# EAGLE design Z80_Main (EAGLE 5.11)
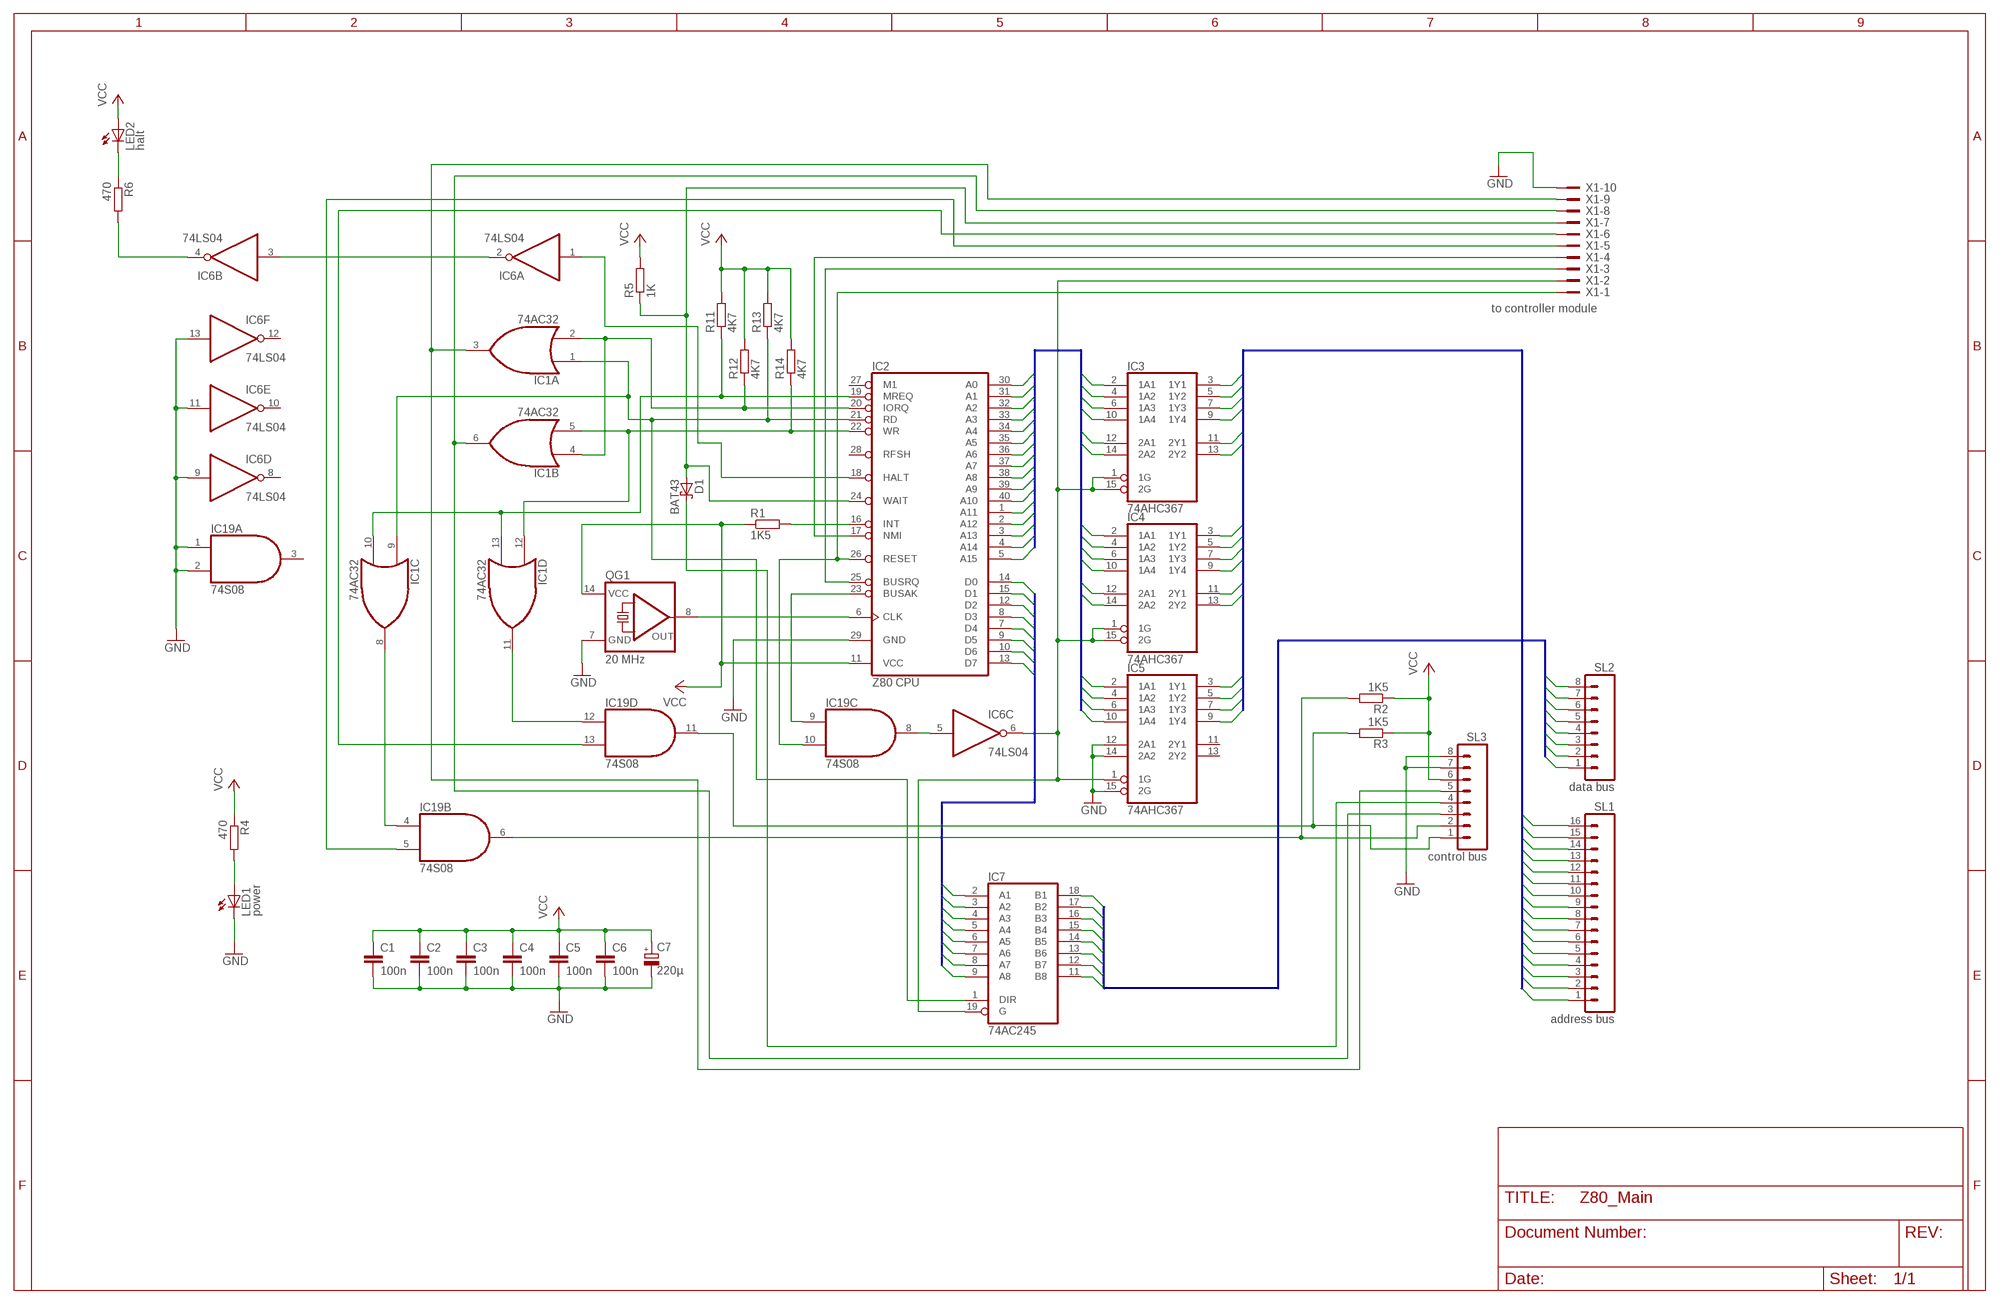
[diagram p0: schematic, sheet 1]

## Parts
C1  100n  C-EU050-025X075  [C050-025X075]
C2  100n  C-EU050-025X075  [C050-025X075]
C3  100n  C-EU050-025X075  [C050-025X075]
C4  100n  C-EU050-025X075  [C050-025X075]
C5  100n  C-EU050-025X075  [C050-025X075]
C6  100n  C-EU050-025X075  [C050-025X075]
C7  220µ  CPOL-EUE3.5-8  [E3,5-8]
D1  BAT43  BAT42  [DO35-10]
IC1  74AC32  74LS32N  [DIL14]
IC2  Z80 CPU  Z80CPU  [DIL40]
IC3  74AHC367  74367N  [DIL16]
IC4  74AHC367  74367N  [DIL16]
IC5  74AHC367  74367N  [DIL16]
IC6  74LS04  7404N  [DIL14]
IC7  74AC245  74LS245N  [DIL20]
IC19  74S08  74LS08N  [DIL14]
LED1  power  LED5MM  [LED5MM]
LED2  halt  LED5MM  [LED5MM]
QG1  20 MHz  QG5860  [DIL14S]
R1  1K5  R-EU_0207/7  [0207/7]
R2  1K5  R-EU_0207/10  [0207/10]
R3  1K5  R-EU_0207/10  [0207/10]
R4  470  R-EU_0207/10  [0207/10]
R5  1K  R-EU_0207/10  [0207/10]
R6  470  R-EU_0207/10  [0207/10]
R11  4K7  R-EU_0207/10  [0207/10]
R12  4K7  R-EU_0207/10  [0207/10]
R13  4K7  R-EU_0207/10  [0207/10]
R14  4K7  R-EU_0207/10  [0207/10]
SL1  address bus  M16  [16P]
SL2  data bus  M08  [08P]
SL3  control bus  M08  [08P]
X1  to controller module  2510-  [PAK100/2500-10]

## Nets
/BUSAK: IC2.23(BUSAK) IC19.9(C:I0)
/BUSRQ: IC2.25(BUSRQ) X1.3
/HALT: IC2.18(HALT) IC6.1(A:I)
/INT: IC2.17(NMI) X1.4
/IORD: IC1.3(A:O) SL3.5 X1.9
/IORQ: IC1.2(A:I1) IC1.4(B:I0) IC2.20(IORQ) R12.1
/IOWR: IC1.6(B:O) SL3.3 X1.8
/MEMRD: IC19.6(B:O) R2.2 SL3.2
/MEMRD_CPU: IC1.8(C:O) IC19.4(B:I0)
/MEMRD_PIC: IC19.5(B:I1) X1.5
/MEMWR: IC19.11(D:O) R3.2 SL3.1
/MEMWR_CPU: IC1.11(D:O) IC19.12(D:I0)
/MEMWR_PIC: IC19.13(D:I1) X1.6
/MREQ: IC1.10(C:I1) IC1.13(D:I1) IC2.19(MREQ) R11.1
/RD: IC1.1(A:I0) IC1.9(C:I0) IC2.21(RD) IC7.1(DIR) R13.1
/RESET: IC2.26(RESET) IC19.10(C:I1) X1.1
/WAIT: D1.A IC2.24(WAIT) R5.1 X1.7
/WAIT0: D1.C SL3.4
/WR: IC1.5(B:I1) IC1.12(D:I0) IC2.22(WR) R14.1
A0: IC2.30(A0) IC3.2(1A1)
A1: IC2.31(A1) IC3.4(1A2)
A2: IC2.32(A2) IC3.6(1A3)
A3: IC2.33(A3) IC3.10(1A4)
A4: IC2.34(A4) IC3.12(2A1)
A5: IC2.35(A5) IC3.14(2A2)
A6: IC2.36(A6) IC4.2(1A1)
A7: IC2.37(A7) IC4.4(1A2)
A8: IC2.38(A8) IC4.6(1A3)
A9: IC2.39(A9) IC4.10(1A4)
A10: IC2.40(A10) IC4.12(2A1)
A11: IC2.1(A11) IC4.14(2A2)
A12: IC2.2(A12) IC5.2(1A1)
A13: IC2.3(A13) IC5.4(1A2)
A14: IC2.4(A14) IC5.6(1A3)
A15: IC2.5(A15) IC5.10(1A4)
AB0: IC3.3(1Y1) SL1.1
AB1: IC3.5(1Y2) SL1.2
AB2: IC3.7(1Y3) SL1.3
AB3: IC3.9(1Y4) SL1.4
AB4: IC3.11(2Y1) SL1.5
AB5: IC3.13(2Y2) SL1.6
AB6: IC4.3(1Y1) SL1.7
AB7: IC4.5(1Y2) SL1.8
AB8: IC4.7(1Y3) SL1.9
AB9: IC4.9(1Y4) SL1.10
AB10: IC4.11(2Y1) SL1.11
AB11: IC4.13(2Y2) SL1.12
AB12: IC5.3(1Y1) SL1.13
AB13: IC5.5(1Y2) SL1.14
AB14: IC5.7(1Y3) SL1.15
AB15: IC5.9(1Y4) SL1.16
BUSAK_RESET: IC3.1(1G) IC3.15(2G) IC4.1(1G) IC4.15(2G) IC5.1(1G) IC6.6(C:O) IC7.19(G) X1.2
CLK: IC2.6(CLK) QG1.8(OUT)
D0: IC2.14(D0) IC7.2(A1)
D1: IC2.15(D1) IC7.3(A2)
D2: IC2.12(D2) IC7.4(A3)
D3: IC2.8(D3) IC7.5(A4)
D4: IC2.7(D4) IC7.6(A5)
D5: IC2.9(D5) IC7.7(A6)
D6: IC2.10(D6) IC7.8(A7)
D7: IC2.13(D7) IC7.9(A8)
DB0: IC7.18(B1) SL2.1
DB1: IC7.17(B2) SL2.2
DB2: IC7.16(B3) SL2.3
DB3: IC7.15(B4) SL2.4
DB4: IC7.14(B5) SL2.5
DB5: IC7.13(B6) SL2.6
DB6: IC7.12(B7) SL2.7
DB7: IC7.11(B8) SL2.8
GND: C1.2 C2.2 C3.2 C4.2 C5.2 C6.2 C7.- IC2.29(GND) IC5.12(2A1) IC5.14(2A2) IC5.15(2G) IC6.9(D:I) IC6.11(E:I) IC6.13(F:I) IC19.1(A:I0) IC19.2(A:I1) LED1.K(C) QG1.7(GND) SL3.7 SL3.8 X1.10
N$1: IC2.16(INT) R1.2
N$2: LED1.A R4.2
N$3: IC6.5(C:I) IC19.8(C:O)
N$4: IC6.2(A:O) IC6.3(B:I)
N$5: IC6.4(B:O) R6.2
N$6: LED2.K(C) R6.1
VCC: C1.1 C2.1 C3.1 C4.1 C5.1 C6.1 C7.+ IC2.11(VCC) LED2.A QG1.14(VCC) R1.1 R2.1 R3.1 R4.1 R5.2 R11.2 R12.2 R13.2 R14.2 SL3.6
Unconnected: IC2.27(M1) IC2.28(RFSH) IC5.11(2Y1) IC5.13(2Y2) IC6.8(D:O) IC6.10(E:O) IC6.12(F:O) IC19.3(A:O)

## Buses
A[0..15]
D[0..7]
AB[0..15]
DB[0..7]

## Power pins joined to a net without a drawn wire
GND: IC1.7(P:GND) IC3.8(GND) IC4.8(GND) IC5.8(GND) IC6.7(P:GND) IC7.10(GND) IC19.7(P:GND)
VCC: IC1.14(P:VCC) IC3.16(VCC) IC4.16(VCC) IC5.16(VCC) IC6.14(P:VCC) IC7.20(VCC) IC19.14(P:VCC)

## Library data of the parts
C1-C6 = rcl:C-EU: CAPACITOR, European symbol
C7 = rcl:CPOL-EU: POLARIZED CAPACITOR, European symbol
D1 = diode:BAT42: DIODE barrier diode
IC1 = 74xx-us:74*32: Quad 2-input OR gate
IC2 = zilog:Z80CPU: Z80 FAMILY DEVICE
IC3-IC5 = 74xx-eu:74*367: Hex BUS DRIVER, 3-state
IC6 = 74xx-eu:74*04: Hex INVERTER
IC7 = 74xx-us:74*245: Octal BUS TRANSCEIVER, 3-state
IC19 = 74xx-us:74*08: Quad 2-input AND gate
LED1 LED2 = led:LED: LED OSRAM: - CHIPLED LG R971, LG N971, LY N971, LG Q971, LY Q971, LO R971, LY R971 LH N974, LH R974 LS Q976, LO Q976, LY Q976 LO Q996 - Hyper CHIPLED LW Q18S LB Q993, LB Q99A, LB R99A - SideLED LS A670, LO A670, LY A670, LG A670, LP A670 LB A673, LV A673, LT A673, LW A673 LH A674 LY A675 LS A676, LA A676, LO A676, LY A676, LW A676 LS A679, LY A679, LG A679 - Hyper Micro SIDELED® LS Y876, LA Y876, LO Y876, LY Y876 LT Y87S - SmartLED LW L88C, LW L88S LB L89C, LB L89S, LG L890 LS L89K, LO L89K, LY L89K LS L896, LA L896, LO L896, LY L896 - TOPLED LS T670, LO T670, LY T670, LG T670, LP T670 LSG T670, LSP T670, LSY T670, LOP T670, LYG T670 LG T671, LOG T671, LSG T671 LB T673, LV T673, LT T673, LW T673 LH T674 LS T676, LA T676, LO T676, LY T676, LB T676, LH T676, LSB T676, LW T676 LB T67C, LV T67C, LT T67C, LS T67K, LO T67K, LY T67K, LW E67C LS E67B, LA E67B, LO E67B, LY E67B, LB E67C, LV E67C, LT E67C LW T67C LS T679, LY T679, LG T679 LS T770, LO T770, LY T770, LG T770, LP T770 LB T773, LV T773, LT T773, LW T773 LH T774 LS E675, LA E675, LY E675, LS T675 LS T776, LA T776, LO T776, LY T776, LB T776 LHGB T686 LT T68C, LB T68C - Hyper Mini TOPLED® LB M676 - Mini TOPLED Santana® LG M470 LS M47K, LO M47K, LY M47K Source: http://www.osram.convergy.de LUXEON: - LUMILED® LXK2-PW12-R00, LXK2-PW12-S00, LXK2-PW14-U00, LXK2-PW14-V00 LXK2-PM12-R00, LXK2-PM12-S00, LXK2-PM14-U00 LXK2-PE12-Q00, LXK2-PE12-R00, LXK2-PE12-S00, LXK2-PE14-T00, LXK2-PE14-U00 LXK2-PB12-K00, LXK2-PB12-L00, LXK2-PB12-M00, LXK2-PB14-N00, LXK2-PB14-P00, LXK2-PB14-Q00 LXK2-PR12-L00, LXK2-PR12-M00, LXK2-PR14-Q00, LXK2-PR14-R00 LXK2-PD12-Q00, LXK2-PD12-R00, LXK2-PD12-S00 LXK2-PH12-R00, LXK2-PH12-S00 LXK2-PL12-P00, LXK2-PL12-Q00, LXK2-PL12-R00 Source: www.luxeon.com KINGBRIGHT: KA-3528ASYC Source: www.kingbright.com
QG1 = crystal:QG5860: CRYSTAL RESONATOR
R1 = resistor:R-EU_: RESISTOR, European symbol
R2-R6 R11-R14 = rcl:R-EU_: RESISTOR, European symbol
SL1 = con-amp-quick:M16: AMP QUICK CONNECTOR
SL2 SL3 = con-amp-quick:M08: AMP QUICK CONNECTOR
X1 = con-3m:2510-: 3M (TM) Pak 100 4-Wall Header Source: 3M

## Board
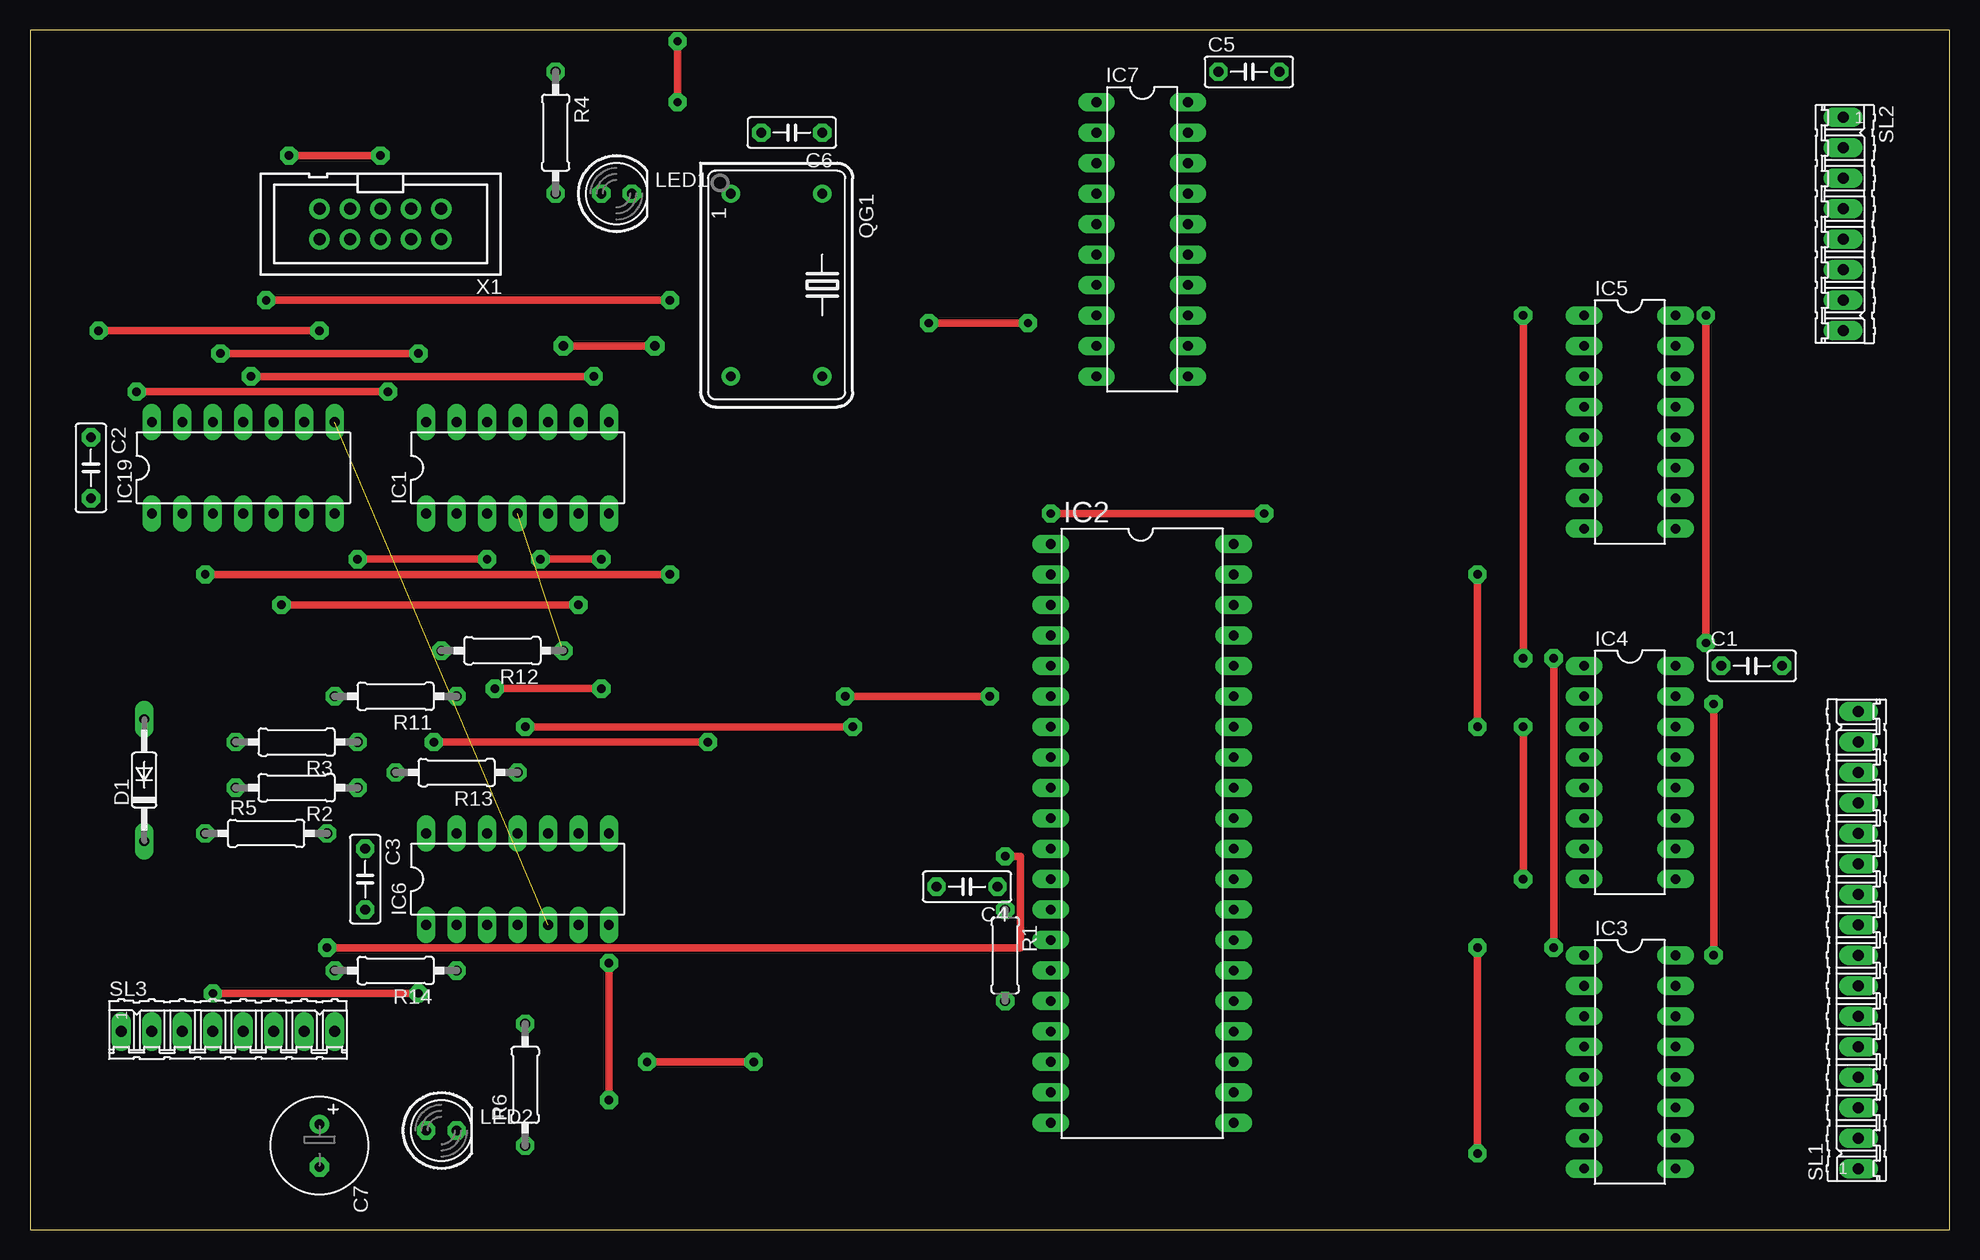
[diagram p1: board, top side]
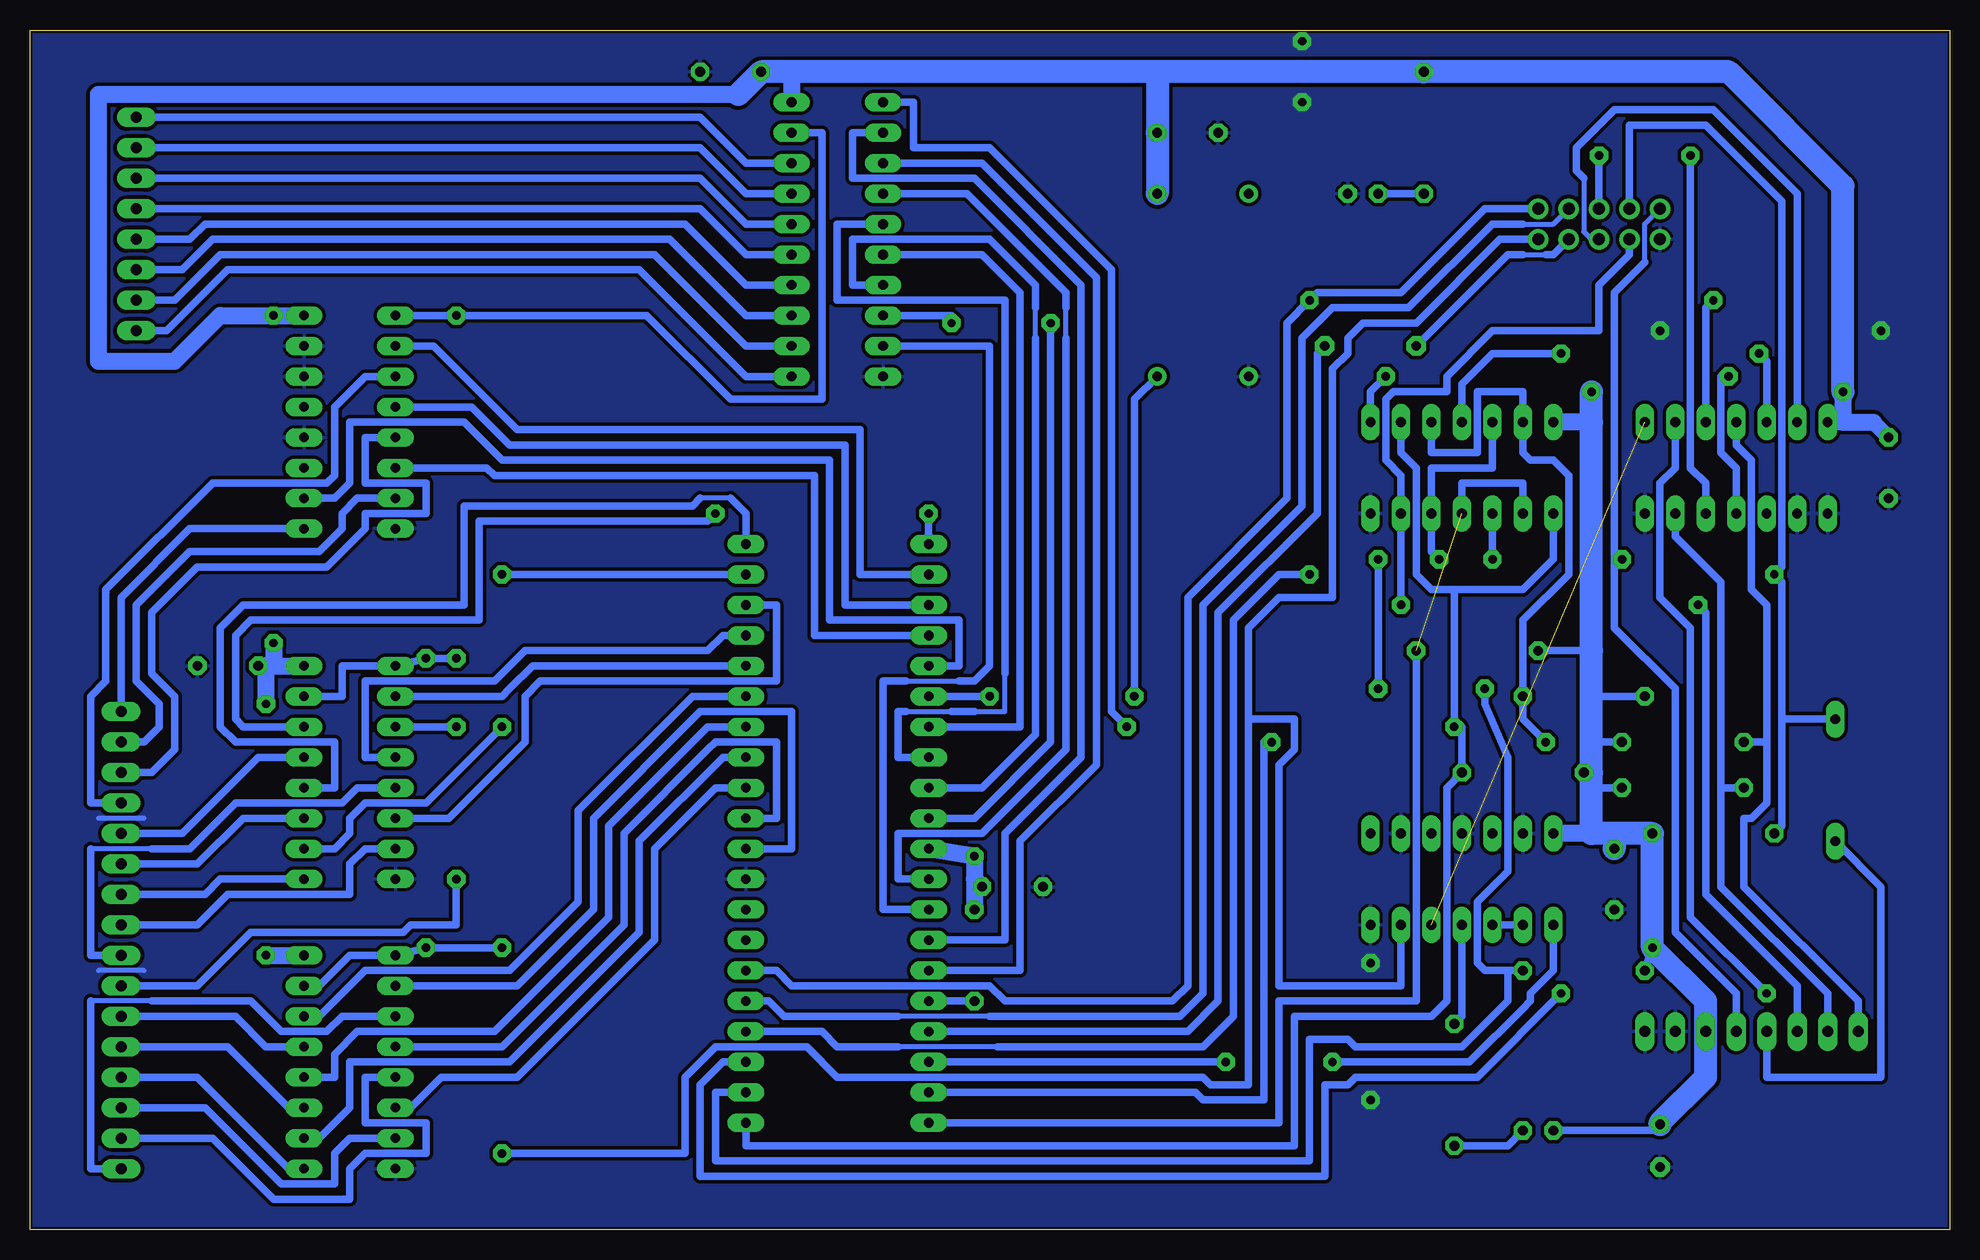
[diagram p2: board, bottom side, seen from below]

Size 160 x 100 mm. Coordinates in mm from the lower left corner, seen from the top.
Outline: 0,0 160,0 160,100 0,100 0,0
Copper layers (1*16): Top 0.035mm / dielectric 1.5mm / Bottom 0.035mm
Design rules "default *": minimum track width 16mil, minimum drill 24mil, track to track 12mil, track to pad 12mil, pad to pad 8mil, via to via 8mil, smd to smd 8mil, copper to edge 8mil, drill to drill 8mil, minimum pad ring 14mil, minimum via ring 16mil, stop-mask expansion 4mil, vias tented up to drill 0mil, thermal gap 10mil

### Footprints (pad centres in the part's own frame; a part is rotated, then mirrored left to right if it is on the bottom)
C050-025X075 = drill 0.813 octagon: 1 -2.54,0; 2 2.54,0
E3,5-8 = drill 0.813 pad 1.6 round: + -1.778,0 | drill 0.813 pad 1.6 octagon: - 1.778,0
DO35-10 = drill 0.813 long: A 5.08,0; C -5.08,0
DIL14 = drill 0.813 long: 1 -7.62,-3.81; 2 -5.08,-3.81; 3 -2.54,-3.81; 4 0,-3.81; 5 2.54,-3.81; 6 5.08,-3.81; 7 7.62,-3.81; 8 7.62,3.81; 9 5.08,3.81; 10 2.54,3.81; 11 0,3.81; 12 -2.54,3.81; 13 -5.08,3.81; 14 -7.62,3.81
DIL40 = drill 0.813 long: 1 -24.13,-7.62; 2 -21.59,-7.62; 3 -19.05,-7.62; 4 -16.51,-7.62; 5 -13.97,-7.62; 6 -11.43,-7.62; 7 -8.89,-7.62; 8 -6.35,-7.62; 9 -3.81,-7.62; 10 -1.27,-7.62; 11 1.27,-7.62; 12 3.81,-7.62; 13 6.35,-7.62; 14 8.89,-7.62; 15 11.43,-7.62; 16 13.97,-7.62; 17 16.51,-7.62; 18 19.05,-7.62; 19 21.59,-7.62; 20 24.13,-7.62; 21 24.13,7.62; 22 21.59,7.62; 23 19.05,7.62; 24 16.51,7.62; 25 13.97,7.62; 26 11.43,7.62; 27 8.89,7.62; 28 6.35,7.62; 29 3.81,7.62; 30 1.27,7.62; 31 -1.27,7.62; 32 -3.81,7.62; 33 -6.35,7.62; 34 -8.89,7.62; 35 -11.43,7.62; 36 -13.97,7.62; 37 -16.51,7.62; 38 -19.05,7.62; 39 -21.59,7.62; 40 -24.13,7.62
DIL16 = drill 0.813 long: 1 -8.89,-3.81; 2 -6.35,-3.81; 3 -3.81,-3.81; 4 -1.27,-3.81; 5 1.27,-3.81; 6 3.81,-3.81; 7 6.35,-3.81; 8 8.89,-3.81; 9 8.89,3.81; 10 6.35,3.81; 11 3.81,3.81; 12 1.27,3.81; 13 -1.27,3.81; 14 -3.81,3.81; 15 -6.35,3.81; 16 -8.89,3.81
DIL20 = drill 0.813 long: 1 -11.43,-3.81; 2 -8.89,-3.81; 3 -6.35,-3.81; 4 -3.81,-3.81; 5 -1.27,-3.81; 6 1.27,-3.81; 7 3.81,-3.81; 8 6.35,-3.81; 9 8.89,-3.81; 10 11.43,-3.81; 11 11.43,3.81; 12 8.89,3.81; 13 6.35,3.81; 14 3.81,3.81; 15 1.27,3.81; 16 -1.27,3.81; 17 -3.81,3.81; 18 -6.35,3.81; 19 -8.89,3.81; 20 -11.43,3.81
LED5MM = drill 0.813 octagon: A -1.27,0; K 1.27,0
DIL14S = drill 0.813 round: 1 -7.62,-3.81; 7 7.62,-3.81; 8 7.62,3.81; 14 -7.62,3.81
0207/7 = drill 0.813 octagon: 1 -3.81,0; 2 3.81,0
0207/10 = drill 0.813 octagon: 1 -5.08,0; 2 5.08,0
16P = drill 0.914 long: 1 -19.05,0; 2 -16.51,0; 3 -13.97,0; 4 -11.43,0; 5 -8.89,0; 6 -6.35,0; 7 -3.81,0; 8 -1.27,0; 9 1.27,0; 10 3.81,0; 11 6.35,0; 12 8.89,0; 13 11.43,0; 14 13.97,0; 15 16.51,0; 16 19.05,0
08P = drill 0.914 long: 1 -8.89,0; 2 -6.35,0; 3 -3.81,0; 4 -1.27,0; 5 1.27,0; 6 3.81,0; 7 6.35,0; 8 8.89,0
PAK100/2500-10 = drill 1 pad 1.422 round: 1 -5.08,-1.27; 2 -5.08,1.27; 3 -2.54,-1.27; 4 -2.54,1.27; 5 0,-1.27; 6 0,1.27; 7 2.54,-1.27; 8 2.54,1.27; 9 5.08,-1.27; 10 5.08,1.27

### Placement (x,y rotation side)
C1  143.51,46.99 0 top
C2  5.08,63.5 270 top
C3  27.94,29.21 270 top
C4  78.11,28.57 180 top
C5  101.6,96.52 0 top
C6  63.5,91.44 180 top
C7  24.13,6.99 270 top
D1  9.53,37.47 90 top
IC1  40.64,63.5 0 top
IC2  92.71,33.02 270 top
IC3  133.35,13.97 270 top
IC4  133.35,38.1 270 top
IC5  133.35,67.31 270 top
IC6  40.64,29.21 0 top
IC7  92.71,82.55 270 top
IC19  17.78,63.5 0 top
LED1  48.9,86.36 0 top
LED2  34.29,8.26 0 top
QG1  62.23,78.74 270 top
R1  81.28,22.86 270 top
R2  22.23,36.83 180 top
R3  22.23,40.64 180 top
R4  43.81,91.44 270 top
R5  19.68,33.02 0 top
R6  41.27,12.06 90 top
R11  30.48,44.45 180 top
R12  39.37,48.26 180 top
R13  35.56,38.1 180 top
R14  30.48,21.59 180 top
SL1  152.4,24.13 90 top
SL2  151.13,83.82 270 top
SL3  16.51,16.51 0 top
X1  29.21,83.82 180 top

### Tracks (layer width: path | path; a pad name or v marks a point on that pad's centre or on a via)
/BUSAK  (via drill 0.7)
  Top 0.61: v15.24,19.68 v32.38,19.68
  Bottom 0.61: IC2.23 102.23,13.97 104.14,12.06 104.14,4.45 52.07,4.45 52.07,12.06 50.16,12.06 49.53,12.7 39.37,12.7 v32.38,19.68 | IC19.9 22.86,63.5 24.13,62.23 24.13,52.7 21.59,50.16 21.59,26.04 v15.24,19.68
/BUSRQ
  Bottom 0.406: 35.56,83.82 33.02,83.82 X1.3 | 80.01,17.78 87.63,17.78
  Bottom 0.61: IC2.25 98.42,19.05 97.16,17.78 87.63,17.78 | 35.56,83.82 38.1,83.82 45.09,76.83 51.44,76.83 53.98,74.3 53.98,60.33 62.23,52.07 62.23,19.68 64.14,17.78 80.01,17.78
/HALT  (via drill 0.7)
  Top 0.61: v51.44,13.97 v60.33,13.97
  Bottom 0.61: IC6.1 33.02,21.59 34.92,19.68 34.92,19.05 35.56,18.41 40.01,13.97 v51.44,13.97 | v60.33,13.97 IC2.18
/INT  (via drill 0.8)
  Top 0.61: v52.07,73.66 v44.45,73.66
  Bottom 0.406: 35.56,81.28 33.66,81.28
  Bottom 0.61: IC2.17 63.5,16.51 60.96,19.05 60.96,51.44 52.7,59.69 52.7,73.03 v52.07,73.66 | X1.4 33.02,81.28 33.66,81.28 | 35.56,81.28 36.83,81.28 v44.45,73.66
/IORD  (via drill 0.7)
  Top 0.61: v27.3,55.88 v38.1,55.88
  Bottom 0.406: 25.4,80.64 25.4,83.82 X1.9
  Bottom 0.61: 27.94,55.88 27.94,78.11 25.4,80.64 | 27.94,55.88 27.94,50.16 22.86,45.09 22.86,24.77 17.78,19.68 SL3.5 | 27.94,55.88 v27.3,55.88 | v38.1,55.88 IC1.3
/IORQ  (1 unrouted)
  Bottom 0.61: IC2.20 55.88,8.89 55.88,19.05 44.45,19.05 R12.1 | IC1.2 35.56,62.23 40.64,62.23 IC1.4
/IOWR  (via drill 0.7)
  Top 0.61: v20.95,52.07 v45.72,52.07
  Bottom 0.61: X1.8 26.67,81.28 29.21,78.74 29.21,74.93 38.1,74.93 41.91,71.12 41.91,69.85 46.35,69.85 46.99,69.22 46.99,64.14 45.72,62.87 IC1.6 v45.72,52.07 | SL3.3 12.7,20.32 20.32,27.94 20.32,51.44 v20.95,52.07
/MEMRD
  Bottom 0.61: IC19.6 22.86,57.78 19.05,53.98 19.05,36.83 | 19.05,36.83 19.05,28.57 10.16,19.68 SL3.2 | 19.05,36.83 R2.2
/MEMRD_CPU  (via drill 0.7)
  Top 0.61: v18.41,71.12 v46.99,71.12
  Bottom 0.61: IC19.4 17.78,63.5 19.05,64.77 19.05,71.12 v18.41,71.12 | v46.99,71.12 48.26,69.85 IC1.8
/MEMRD_PIC  (via drill 0.7)
  Top 0.61: v21.59,89.53 v29.21,89.53
  Bottom 0.61: v21.59,89.53 21.59,76.83 21.59,63.5 20.32,62.23 IC19.5 | v29.21,89.53 X1.5
/MEMWR
  Bottom 0.61: IC19.11 17.78,65.41 16.51,64.14 16.51,53.34 15.24,52.07 15.24,40.64 | 15.24,40.64 15.24,35.56 16.51,34.29 17.14,34.29 17.14,28.57 7.62,19.05 SL3.1 | 15.24,40.64 R3.2
/MEMWR_CPU  (via drill 0.7)
  Top 0.61: v15.88,73.03 v32.38,73.03
  Bottom 0.61: IC19.12 15.24,72.39 v15.88,73.03 | v32.38,73.03 38.1,73.03 40.64,70.48 IC1.11
/MEMWR_PIC
  Bottom 0.406: 30.48,87.63 30.48,83.19 29.84,82.55 X1.6
  Bottom 0.61: IC19.13 12.7,86.36 19.68,93.34 27.94,93.34 31.11,90.17 31.11,88.27 30.48,87.63
/MREQ  (via drill 0.7)
  Top 0.61: v56.52,40.64 v33.66,40.64
  Bottom 0.61: IC2.19 80.01,11.43 62.87,11.43 62.23,10.79 57.15,10.79 57.15,40.64 v56.52,40.64 | v33.66,40.64 35.56,42.55 R11.1 35.56,50.8 31.75,54.61 31.75,62.87 33.02,64.14 34.92,64.14 35.56,64.77 IC1.13 35.56,69.85 39.37,69.85 39.37,64.77 43.18,64.77 IC1.10
/RD  (via drill 0.7)
  Top 0.61: v41.27,41.91 v68.58,41.91
  Bottom 0.61: IC7.1 86.36,93.98 86.36,90.17 80.01,90.17 69.85,80.01 69.85,43.18 v68.58,41.91 | IC2.21 100.33,6.99 54.61,6.99 54.61,17.78 43.18,17.78 41.91,19.05 41.91,20.32 41.91,36.83 R13.1 40.64,41.91 v41.27,41.91 41.27,53.34 | IC1.1 33.02,55.88 35.56,53.34 41.27,53.34 | 41.27,53.34 43.18,53.34 44.45,54.61 44.45,63.5 45.72,64.77 IC1.9
/RESET  (via drill 0.7)
  Top 0.61: v53.34,77.47 v19.68,77.47
  Bottom 0.61: IC2.26 97.79,21.59 96.52,20.32 80.01,20.32 78.74,19.05 64.77,19.05 63.5,20.32 63.5,52.7 55.24,60.96 55.24,75.56 v53.34,77.47 52.7,78.11 45.72,78.11 38.73,85.09 X1.1 | v19.68,77.47 20.32,76.83 IC19.10
/WAIT  (via drill 0.7)
  Top 0.61: v14.61,54.61 v53.34,54.61
  Bottom 0.406: 79.38,15.24 87.63,15.24
  Bottom 0.61: X1.7 26.67,92.08 20.32,92.08 13.97,85.72 13.97,55.24 v14.61,54.61 13.97,53.98 13.97,42.55 | v53.34,54.61 55.88,54.61 59.69,50.8 59.69,17.78 62.23,15.24 79.38,15.24 | IC2.24 93.98,16.51 92.71,15.24 87.63,15.24 | 13.97,42.55 D1.A | R5.1 13.97,33.66 13.97,42.55
/WAIT0
  Bottom 0.61: SL3.4 15.24,12.7 5.71,12.7 5.71,28.57 D1.C
/WR  (via drill 0.7)
  Top 0.61: v47.62,55.88 v42.55,55.88 | v38.73,45.09 v47.62,45.09
  Bottom 0.61: IC2.22 102.87,11.43 102.87,5.71 53.34,5.71 53.34,15.88 50.16,15.88 49.53,15.24 40.64,15.24 36.83,19.05 36.83,21.59 | 36.83,21.59 R14.1 | v38.73,45.09 38.73,43.81 36.83,39.37 36.83,29.84 39.37,27.3 39.37,22.23 38.73,21.59 36.83,21.59 | IC1.12 38.1,63.5 43.18,63.5 IC1.5 43.18,56.52 v42.55,55.88 | v47.62,45.09 v47.62,55.88
A0
  Bottom 0.61: IC3.2 119.38,20.32 113.03,26.67 113.03,34.29 104.78,42.55 104.14,43.18 96.52,43.18 96.52,31.75 IC2.30
A1
  Bottom 0.61: IC3.4 120.65,15.24 110.49,25.4 110.49,33.02 103.5,40.01 102.87,40.64 97.79,40.64 97.79,34.29 IC2.31
A2
  Bottom 0.61: IC3.6 128.27,10.16 125.73,12.7 119.38,12.7 107.95,24.13 107.95,31.75 102.87,36.83 IC2.32
A3
  Bottom 0.61: IC3.10 135.89,7.62 133.35,10.16 133.35,13.97 120.02,13.97 109.22,24.77 109.22,32.38 102.23,39.37 IC2.33
A4
  Bottom 0.61: IC2.34 103.5,41.91 111.76,33.66 111.76,26.04 121.28,16.51 132.72,16.51 134.62,14.61 134.62,12.7 IC3.12
A5
  Bottom 0.61: IC3.14 135.89,17.78 132.08,21.59 120.02,21.59 114.3,27.3 114.3,34.92 104.78,44.45 IC2.35
A6
  Bottom 0.61: IC2.36 118.11,46.99 120.02,45.09 120.65,44.45 IC4.2
A7
  Bottom 0.61: IC2.37 102.23,49.53 103.5,48.26 118.75,48.26 121.28,45.72 132.08,45.72 132.08,39.37 IC4.4
A8
  Bottom 0.61: IC4.6 125.09,34.29 118.75,40.64 118.75,44.45 117.47,45.72 97.79,45.72 97.79,52.07 IC2.38
A9  (via drill 0.7)
  Top 0.61: v120.65,54.61 v120.65,41.91
  Bottom 0.61: IC4.10 134.62,31.75 133.35,33.02 133.35,34.29 132.08,35.56 127,35.56 v120.65,41.91 | IC2.39 v120.65,54.61
A10
  Bottom 0.406: 101.6,60.96 104.14,60.96
  Bottom 0.61: IC4.12 134.62,36.83 134.62,40.64 142.88,40.64 144.15,41.91 144.15,50.16 142.24,52.07 123.83,52.07 123.83,60.33 104.78,60.33 104.14,60.96 | 101.6,60.96 100.33,59.69 IC2.40
A11  (via drill 0.7)
  Top 0.61: v85.09,59.69 v102.87,59.69
  Bottom 0.61: IC4.14 141.6,41.91 142.24,41.91 142.88,42.55 142.88,49.53 141.6,50.8 122.56,50.8 122.56,59.05 103.5,59.05 v102.87,59.69 | IC2.1 v85.09,59.69
A12
  Bottom 0.61: IC5.2 126.36,73.66 119.38,66.67 90.81,66.67 90.81,54.61 IC2.2
A13
  Bottom 0.61: IC2.3 92.08,52.07 92.08,65.41 120.02,65.41 123.19,68.58 IC5.4
A14
  Bottom 0.61: IC5.6 121.92,63.5 121.28,62.87 94.61,62.87 94.61,49.53 IC2.4
A15
  Bottom 0.61: IC5.10 134.62,60.96 133.35,62.23 133.35,67.31 123.83,67.31 120.65,64.14 93.34,64.14 93.34,50.8 82.55,50.8 82.55,46.99 IC2.5
AB0
  Bottom 0.406: 149.86,19.05 154.94,19.05
  Bottom 0.61: IC3.3 133.99,17.78 135.25,16.51 139.06,16.51 141.6,19.05 149.86,19.05 | 154.94,19.05 154.94,5.08 SL1.1
AB1
  Bottom 0.61: IC3.5 132.08,12.7 132.08,8.89 127,8.89 127,6.35 132.08,6.35 133.35,5.08 133.35,2.54 139.7,2.54 144.78,7.62 SL1.2
AB2
  Bottom 0.61: IC3.7 133.35,7.62 134.62,6.35 134.62,3.81 139.06,3.81 145.41,10.16 SL1.3
AB3
  Bottom 0.61: IC3.9 138.43,5.08 146.05,12.7 SL1.4
AB4
  Bottom 0.61: IC3.11 138.43,10.16 143.51,15.24 SL1.5
AB5
  Bottom 0.61: IC3.13 140.34,15.24 142.88,17.78 SL1.6
AB6  (via drill 0.7)
  Top 0.61: v124.46,29.21 v124.46,41.91
  Bottom 0.61: v124.46,29.21 124.46,25.4 128.27,25.4 128.91,24.77 141.6,24.77 146.05,20.32 SL1.7 | v124.46,41.91 IC4.3
AB7
  Bottom 0.406: 149.86,31.75 154.94,31.75
  Bottom 0.61: IC4.5 132.72,36.83 133.99,35.56 142.88,35.56 146.69,31.75 149.86,31.75 | 154.94,31.75 154.94,22.86 SL1.8
AB8
  Bottom 0.61: IC4.7 132.08,31.75 133.35,30.48 133.35,27.94 143.51,27.94 146.05,25.4 SL1.9
AB9
  Bottom 0.61: IC4.9 144.15,29.21 145.41,27.94 SL1.10
AB10
  Bottom 0.61: IC4.11 142.24,34.29 146.05,30.48 SL1.11
AB11
  Bottom 0.61: IC4.13 140.97,39.37 147.32,33.02 SL1.12
AB12
  Bottom 0.61: IC5.3 132.08,71.12 134.62,68.58 134.62,62.87 135.25,62.23 144.78,62.23 153.67,53.34 153.67,45.72 154.94,44.45 154.94,35.56 SL1.13
AB13
  Bottom 0.61: IC5.5 132.08,66.04 132.08,62.23 127,62.23 127,59.69 132.08,59.69 132.08,58.42 135.25,55.24 146.05,55.24 149.86,51.44 149.86,46.35 147.96,44.45 147.96,40.01 149.86,38.1 SL1.14
AB14
  Bottom 0.61: IC5.7 132.72,60.96 133.99,59.69 133.99,58.42 135.89,56.52 146.69,56.52 151.13,52.07 151.13,45.72 149.22,43.81 149.22,41.91 150.5,40.64 SL1.15
AB15
  Bottom 0.61: SL1.16 152.4,52.7 146.69,58.42 IC5.9
BUSAK_RESET  (via drill 0.7)
  Top 0.61: v127,23.5 v127,47.62 | v124.46,47.62 v124.46,76.2 | v120.65,6.35 v120.65,23.5
  Bottom 0.61: IC3.15 135.89,20.32 133.35,22.86 IC3.1 v127,23.5 v120.65,23.5 | IC4.15 133.99,44.45 133.99,46.99 IC4.1 v127,47.62 v124.46,47.62 | IC5.1 v124.46,76.2 108.58,76.2 101.6,69.22 93.98,69.22 93.98,91.44 IC7.19 | v120.65,6.35 105.41,6.35 105.41,12.7 102.87,15.24 95.25,15.24 92.71,12.7 62.23,12.7 61.59,12.06 58.42,12.06 58.42,42.55 | 58.42,42.55 58.42,50.16 55.88,52.7 51.44,52.7 51.44,71.75 50.16,73.03 50.16,74.3 48.9,75.56 44.45,75.56 37.47,82.55 X1.2 | IC6.6 45.72,20.32 55.88,20.32 55.88,38.73 54.61,40.01 54.61,42.55 58.42,42.55
CLK  (via drill 0.7)
  Top 0.61: v67.94,44.45 v80.01,44.45
  Bottom 0.61: v80.01,44.45 IC2.6 | v67.94,44.45 67.94,69.22 QG1.8
D0
  Bottom 0.61: IC2.14 78.74,24.13 78.74,33.02 72.39,39.37 72.39,78.74 81.28,87.63 91.44,87.63 91.44,91.44 IC7.2
D1
  Bottom 0.61: IC7.3 80.64,88.9 71.12,79.38 71.12,38.73 77.47,32.38 77.47,21.59 IC2.15
D2
  Bottom 0.406: 73.66,74.3 73.66,76.83
  Bottom 0.61: IC7.4 81.92,86.36 73.66,78.11 73.66,76.83 | IC2.12 87.63,29.21 87.63,33.02 80.64,33.02 73.66,40.01 73.66,74.3
D3
  Bottom 0.406: 87,43.18 83.19,43.18 | 81.28,43.18 78.74,43.18 78.74,46.35
  Bottom 0.61: IC2.8 87.63,39.37 87.63,43.18 87,43.18 | IC7.5 92.71,83.82 92.71,77.47 78.74,77.47 78.74,46.35 | 83.19,43.18 81.28,43.18
D4
  Bottom 0.61: IC2.7 77.47,41.91 77.47,78.11 80.64,81.28 IC7.6
D5
  Bottom 0.406: 76.2,74.3 76.2,76.83
  Bottom 0.61: IC7.7 91.44,78.74 91.44,82.55 80.01,82.55 76.2,78.74 76.2,76.83 | IC2.9 80.64,36.83 76.2,41.27 76.2,74.3
D6  (via drill 0.7)
  Top 0.61: v74.93,75.56 v83.19,75.56
  Bottom 0.61: IC2.10 81.28,34.29 74.93,40.64 v74.93,75.56 | v83.19,75.56 83.19,76.2 IC7.8
D7
  Bottom 0.406: 87,45.72 82.55,45.72
  Bottom 0.61: IC2.13 88.9,26.67 88.9,45.72 87.63,45.72 87,45.72 | IC7.9 80.01,73.66 80.01,46.99 81.28,45.72 82.55,45.72
DB0
  Bottom 0.61: IC7.18 100.33,88.9 104.14,92.71 SL2.1
DB1
  Bottom 0.61: IC7.17 100.33,86.36 104.14,90.17 SL2.2
DB2
  Bottom 0.61: IC7.16 100.33,83.82 104.14,87.63 SL2.3
DB3
  Bottom 0.61: IC7.15 100.33,81.28 104.14,85.09 SL2.4
DB4
  Bottom 0.61: IC7.14 100.33,78.74 105.41,83.82 144.78,83.82 145.41,83.82 146.69,82.55 SL2.5
DB5
  Bottom 0.61: IC7.13 100.33,76.2 106.68,82.55 144.78,82.55 147.32,80.01 SL2.6
DB6
  Bottom 0.61: IC7.12 100.33,73.66 107.95,81.28 144.15,81.28 147.96,77.47 SL2.7
DB7
  Bottom 0.61: IC7.11 100.33,71.12 109.22,80.01 143.51,80.01 148.59,74.93 SL2.8
GND  (via drill 0.7)
  Top 0.61: v48.26,10.79 v48.26,22.23 | v5.71,74.93 v24.13,74.93 | v53.98,93.98 v53.98,99.06
  Bottom 0.406: 150.5,21.59 154.31,21.59 | 150.5,34.29 154.31,34.29
  pour Bottom: 0,100.33 0,0 160.02,0 160.02,100.33
N$1
  Bottom 0.61: R1.2 IC2.16
N$2
  Bottom 0.61: R4.2 LED1.A
N$3  (1 unrouted)
N$4
  Bottom 0.61: IC6.2 IC6.3
N$5
  Bottom 0.61: R6.2 40.64,17.78 40.64,18.41 IC6.4
N$6
  Bottom 0.61: LED2.K 36.83,6.99 R6.1
VCC  (via drill 0.7)
  Top 0.61: v140.34,43.81 v140.34,22.86 | v29.84,69.85 v8.89,69.85 | v139.7,76.2 v139.7,48.9 | v24.77,23.5 82.55,23.5 82.55,31.11 v81.28,31.11
  Bottom 0.61: 29.84,44.45 R11.2 | 29.84,48.26 R12.2 | v24.77,23.5 R14.2 | 29.84,38.1 R13.2 | 29.84,40.64 R3.1 | 29.84,36.83 R2.1 | LED2.A 24.64,8.26 C7.+
  Bottom 1.27: 139.7,46.99 140.34,46.99 | 6.35,67.31 C2.1 | IC7.20 96.52,95.25
  Bottom 1.422: 29.84,33.02 IC6.14 | 29.84,67.31 IC1.14 | 81.28,29.21 R1.1 | 81.28,29.21 v81.28,31.11 IC2.11 | v140.34,22.86 IC3.16 | v140.34,43.81 140.34,46.99 C1.1 | 96.52,96.52 IC7.20 | v139.7,48.9 139.7,46.99 IC4.16 | IC5.16 v139.7,76.2 144.15,76.2 147.96,72.39 154.31,72.39 154.31,94.61 100.97,94.61 | 81.28,29.21 C4.1 | 8.89,67.31 6.35,67.31 | v8.89,69.85 8.89,67.31 | 8.89,67.31 IC19.14
  Bottom 1.93: 27.94,33.02 R5.2 v24.77,23.5 20.32,19.05 SL3.6 20.32,12.7 24.13,8.89 C7.+ | 27.94,33.02 29.84,33.02 29.84,36.83 29.84,38.1 29.84,40.64 29.84,44.45 29.84,48.26 29.84,67.31 v29.84,69.85 | 27.94,33.02 C3.1 | 66.04,96.52 96.52,96.52 C5.1 100.97,94.61 | 66.04,96.52 C6.1 QG1.14 | 66.04,96.52 R4.1 18.41,96.52 8.89,87 v8.89,69.85